# Altium schematic sheet Power_Supply.SchDoc
size A
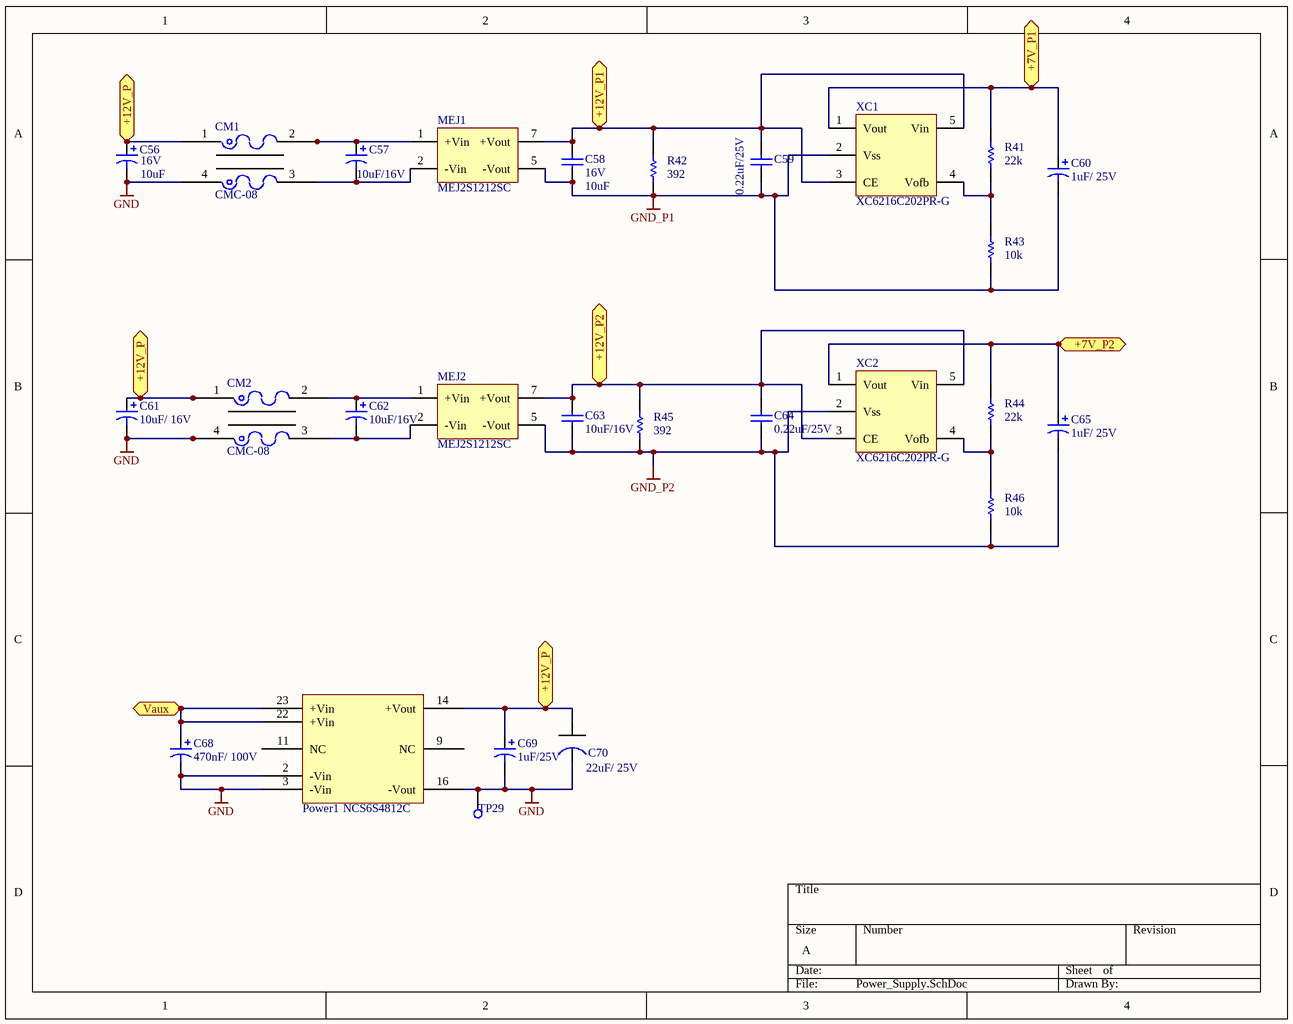
[diagram p0: Power_Supply.SchDoc]

## Parts
C56  16V  value 10uF  [1812]
C57  value 10uF/16V  [1812]  (hidden comment: Cap Pol3)
C58  16V  value 10uF  [C1206]
C59  value 0.22uF/25V  [C1206]  (hidden comment: Cap Semi)
C60  value 1uF/ 25V  [C0805]  (hidden comment: Cap Pol3)
C61  value 10uF/ 16V  [1812]  (hidden comment: Cap Pol3)
C62  value 10uF/16V  [1812]  (hidden comment: Cap Pol3)
C63  value 10uF/16V  [C1206]  (hidden comment: Cap Semi)
C64  value 0.22uF/25V  [C1206]  (hidden comment: Cap Semi)
C65  value 1uF/ 25V  [C0805]  (hidden comment: Cap Pol3)
C68  value 470nF/ 100V  [C0805]  (hidden comment: Cap Pol3)
C69  value 1uF/25V  [C0805]  (hidden comment: Cap Pol3)
C70  22uF  [Cap_tantalum]  (value not drawn)
CM1  CMC-08  [CMC-08]
CM2  CMC-08  [CMC-08]
MEJ1  MEJ2S1212SC  [MEJ2]
MEJ2  MEJ2S1212SC  [MEJ2]
Power1  NCS6S4812C  [Power_main]
R41  res_smd  [res_smd]  (value not drawn)
R42  res_smd  [res_smd]  (value not drawn)
R43  res_smd  [res_smd]  (value not drawn)
R44  res_smd  [res_smd]  (value not drawn)
R45  res_smd  [res_smd]  (value not drawn)
R46  res_smd  [res_smd]  (value not drawn)
TP29  Test Point  [Test Point]  (value not drawn)
XC1  XC6216C202PR-G  [SOT-89-5]
XC2  XC6216C202PR-G  [SOT-89-5]

## Ports
+7V_P1 (bidir), +7V_P2 (bidir), +12V_P1 (bidir), +12V_P2 (bidir), +12V_P (bidir), Vaux

## Nets
GND: C56.2 C61.2 C68.2 C69.2 C70.2 CM1.4 CM2.4 Power1.2(-Vin) Power1.3(-Vin) Power1.16(-Vout) TP29.1(TP?)
GND_P1: C58.1 C59.1 C60.2 MEJ1.5(-Vout) R42.2 R43.2 XC1.2(Vss)
GND_P2: C63.1 C64.1 C65.2 MEJ2.5(-Vout) R45.2 R46.2 XC2.2(Vss)
+7V_P1: C60.1 R41.1 XC1.1(Vout) ; port +7V_P1
+7V_P2: C65.1 R44.1 XC2.1(Vout) ; port +7V_P2
+12V_P: C56.1 C61.1 C69.1 C70.1 CM1.1 CM2.1 Power1.14(+Vout) ; port +12V_P
+12V_P1: C58.2 C59.2 MEJ1.7(+Vout) R42.1 XC1.3(CE) XC1.5(Vin) ; port +12V_P1
+12V_P2: C63.2 C64.2 MEJ2.7(+Vout) R45.1 XC2.3(CE) XC2.5(Vin) ; port +12V_P2
Vaux: C68.1 Power1.22(+Vin) Power1.23(+Vin) ; port Vaux
NetC57_1: C57.1 CM1.2 MEJ1.1(+Vin)
NetC57_2: C57.2 CM1.3 MEJ1.2(-Vin)
NetC62_1: C62.1 CM2.2 MEJ2.1(+Vin)
NetC62_2: C62.2 CM2.3 MEJ2.2(-Vin)
NetR41_2: R41.2 R43.1 XC1.4(Vofb)
NetR44_2: R44.2 R46.1 XC2.4(Vofb)

Not connected (* = marked no-connect by the designer): Power1 9(NC) 11(NC)

## Notes on the sheet
- (in symbol Cap_tantalum) 22uF/ 25V
- (in symbol res_smd) 392; 22k; 10k

## Library data of the parts
C56 C57 C60-C62 C65 C68 C69 = Cap Pol3: Polarized Capacitor (Surface Mount); Published: 8-Jun-2000; LatestRevisionDate: 29-May-2009; LatestRevisionNote: IPC-7351 Footprint Added.; PackageReference: C0805; Publisher: Altium Limited; PackageDescription: Chip Capacitor
C58 C59 C63 C64 = Cap Semi: Capacitor (Semiconductor SIM Model); Published: 8-Jun-2000; LatestRevisionDate: 29-May-2009; LatestRevisionNote: IPC-7351 Footprint Added.; PackageReference: C1206; Publisher: Altium Limited; PackageDescription: Chip Capacitor
C70 = Cap_tantalum
CM1 CM2 = CMC-08: Common mode choke
MEJ1 MEJ2 = Power supply2
Power1 = Power_main
R41-R46 = res_smd: smd_res
XC1 XC2 = power supply